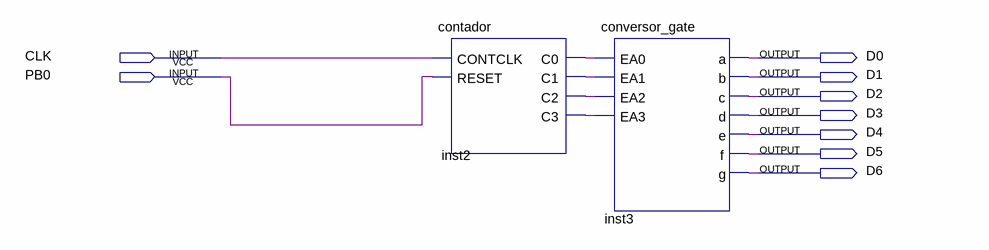
[diagram p0: schematic sheet]
// Quartus schematic gerador_de_sequencia.bdf as structural Verilog: 2 symbols, 9 pins
module gerador_de_sequencia (
  input  CLK,
  input  PB0,
  output D0,
  output D1,
  output D2,
  output D3,
  output D4,
  output D5,
  output D6
);

  wire inst2_c0, inst2_c1, inst2_c2, inst2_c3;

  contador inst2 (.CONTCLK(CLK), .RESET(PB0), .C0(inst2_c0), .C1(inst2_c1), .C2(inst2_c2), .C3(inst2_c3));
  conversor_gate inst3 (
    .EA0(inst2_c0), .EA1(inst2_c1), .EA2(inst2_c2), .EA3(inst2_c3), .a(D0), .b(D1), .c(D2), .d(D3), .e(D4),
    .f(D5), .g(D6));
endmodule
